# EAGLE design CoCoMEM_RAM (EAGLE 7.7.0)

## Sheet 1 of 3
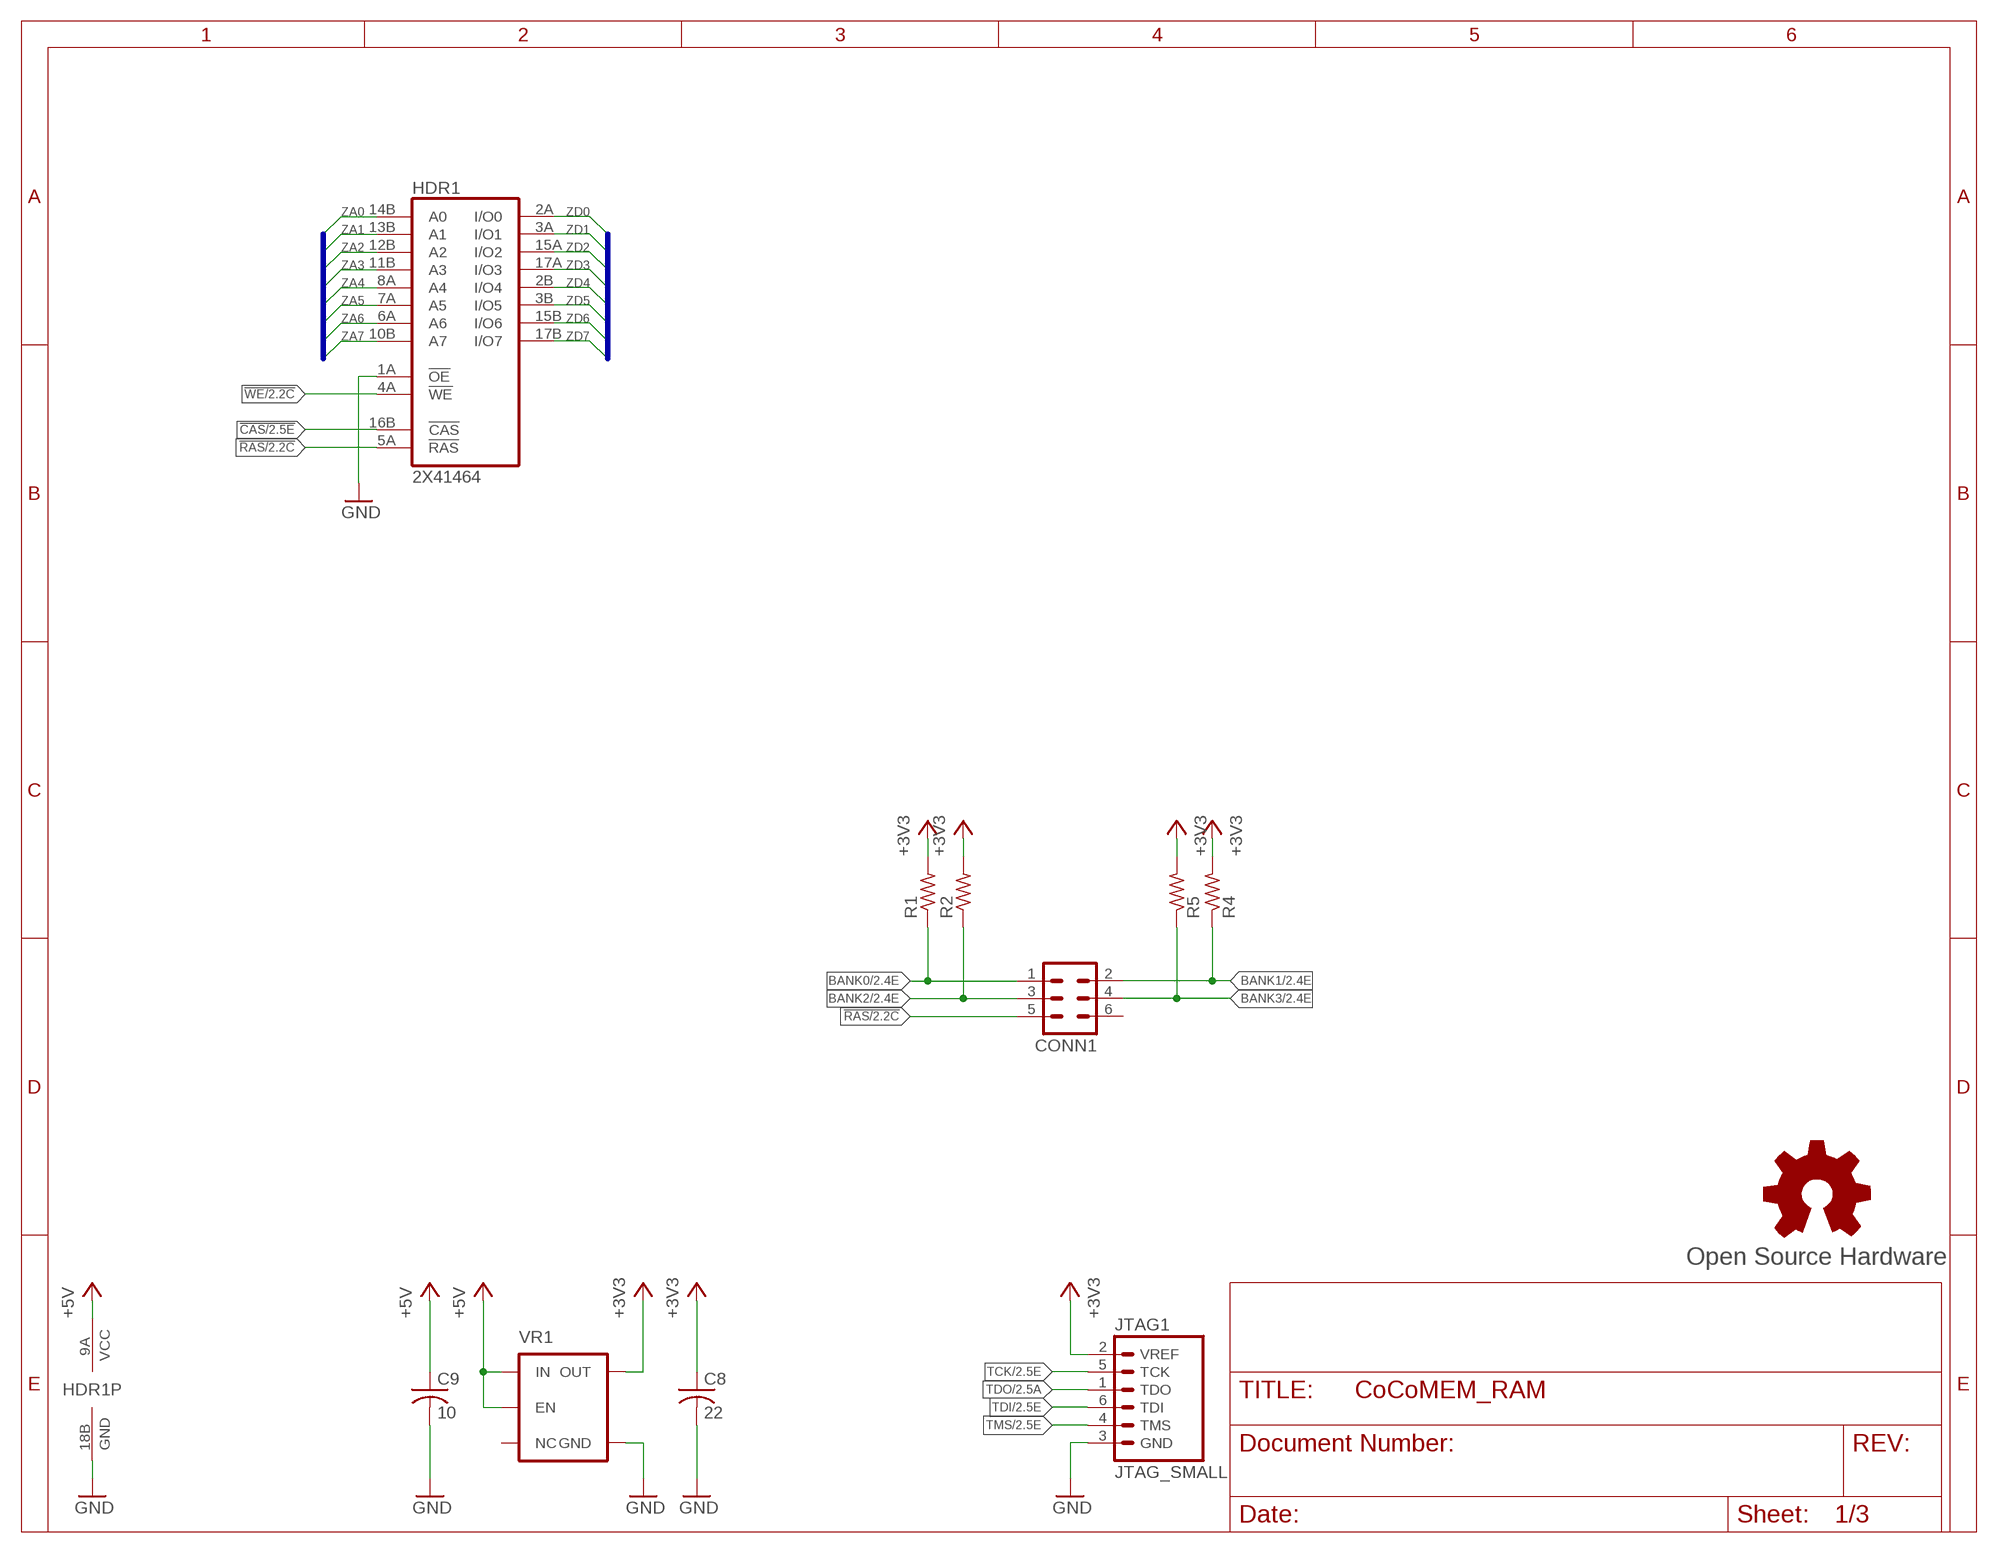
[diagram p0: schematic, sheet 1]

### Parts
C8  22  C-USC0805  [C0805]
C9  10  C-USC0805  [C0805]
CONN1  MA03-2  [MA03-2]
GOLD_ORB_SM1  Open Source Hardware  OSHWLOGOLOGO5MM  [OSHW_5MM]
HDR1  2X41464  [2XDIL18_REV]
JTAG1  JTAG_SMALL  [JTAG-6]
R1  R-US_R0402  [R0402]
R2  R-US_R0402  [R0402]
R4  R-US_R0402  [R0402]
R5  R-US_R0402  [R0402]
VR1  V_REG_TPS76433SOT23-5  [SOT23-5]

### Nets
!CAS: HDR1.16B(!CAS) ; also sheet 2
!RAS: CONN1.5 HDR1.5A(!RAS) ; also sheet 2
!WE: HDR1.4A(!WE) ; also sheet 2
+3V3: C8.1 JTAG1.2(VREF) R1.2 R2.2 R4.2 R5.2 VR1.5(OUT) ; also sheet 2,3
+5V: C9.1 HDR1.9A(VCC) VR1.1(IN) VR1.3(EN)
BANK0: CONN1.1 R1.1 ; also sheet 2
BANK1: CONN1.2 R4.1 ; also sheet 2
BANK2: CONN1.3 R2.1 ; also sheet 2
BANK3: CONN1.4 R5.1 ; also sheet 2
GND: C8.2 C9.2 HDR1.1A(!OE) HDR1.18B(GND) JTAG1.3(GND) VR1.2(GND) ; also sheet 2,3
TCK: JTAG1.5(TCK) ; also sheet 2
TDI: JTAG1.6(TDI) ; also sheet 2
TDO: JTAG1.1(TDO) ; also sheet 2
TMS: JTAG1.4(TMS) ; also sheet 2
ZA0: HDR1.14B(A0) ; also sheet 2
ZA1: HDR1.13B(A1) ; also sheet 2
ZA2: HDR1.12B(A2) ; also sheet 2
ZA3: HDR1.11B(A3) ; also sheet 2
ZA4: HDR1.8A(A4) ; also sheet 2
ZA5: HDR1.7A(A5) ; also sheet 2
ZA6: HDR1.6A(A6) ; also sheet 2
ZA7: HDR1.10B(A7) ; also sheet 2
ZD0: HDR1.2A(I/O0) ; also sheet 2
ZD1: HDR1.3A(I/O1) ; also sheet 2
ZD2: HDR1.15A(I/O2) ; also sheet 2
ZD3: HDR1.17A(I/O3) ; also sheet 2
ZD4: HDR1.2B(I/O4) ; also sheet 2
ZD5: HDR1.3B(I/O5) ; also sheet 2
ZD6: HDR1.15B(I/O6) ; also sheet 2
ZD7: HDR1.17B(I/O7) ; also sheet 2
Unconnected: CONN1.6 VR1.4(NC)

### Buses
ZD[0..7]
ZA[0..7]

## Sheet 2 of 3
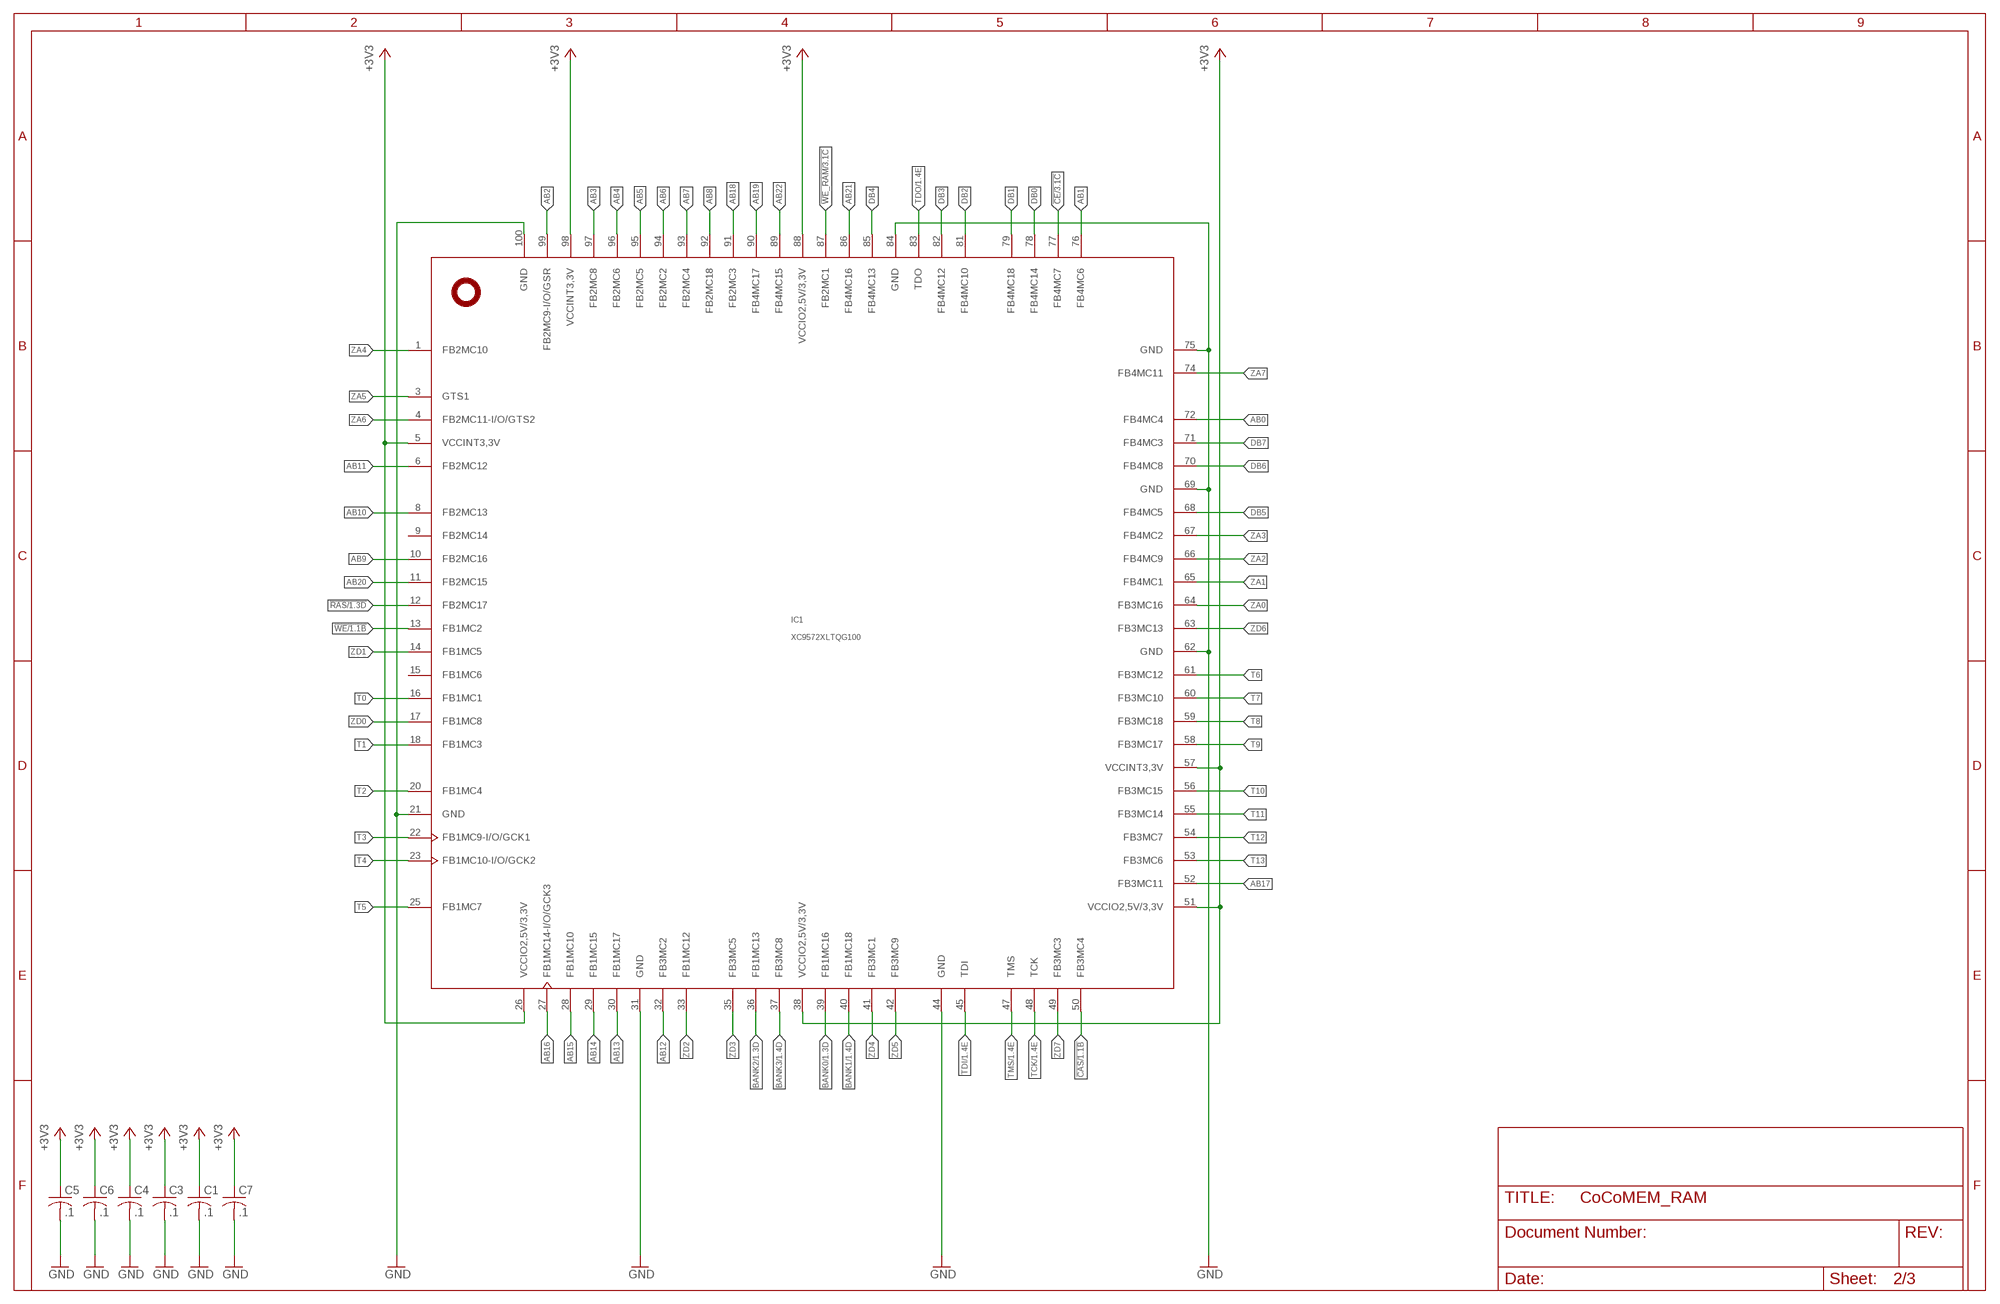
[diagram p1: schematic, sheet 2]

### Parts
C1  .1  C-USC0603  [C0603]
C3  .1  C-USC0603  [C0603]
C4  .1  C-USC0603  [C0603]
C5  .1  C-USC0603  [C0603]
C6  .1  C-USC0603  [C0603]
C7  .1  C-USC0603  [C0603]
IC1  XC9572XLTQG100  [TQFP100]

### Nets
!CAS: IC1.50(FB3MC4) ; also sheet 1
!CE: IC1.77(FB4MC7) ; also sheet 3
!RAS: IC1.12(FB2MC17) ; also sheet 1
!WE: IC1.13(FB1MC2) ; also sheet 1
!WE_RAM: IC1.87(FB2MC1) ; also sheet 3
+3V3: C1.1 C3.1 C4.1 C5.1 C6.1 C7.1 IC1.5(VCCINT3,3V) IC1.26(VCCIO2,5V/3,3V) IC1.38(VCCIO2,5V/3,3V) IC1.51(VCCIO2,5V/3,3V) IC1.57(VCCINT3,3V) IC1.88(VCCIO2,5V/3,3V) IC1.98(VCCINT3,3V) ; also sheet 1,3
AB0: IC1.72(FB4MC4) ; also sheet 3
AB1: IC1.76(FB4MC6) ; also sheet 3
AB2: IC1.99(FB2MC9-I/O/GSR) ; also sheet 3
AB3: IC1.97(FB2MC8) ; also sheet 3
AB4: IC1.96(FB2MC6) ; also sheet 3
AB5: IC1.95(FB2MC5) ; also sheet 3
AB6: IC1.94(FB2MC2) ; also sheet 3
AB7: IC1.93(FB2MC4) ; also sheet 3
AB8: IC1.92(FB2MC18) ; also sheet 3
AB9: IC1.10(FB2MC16) ; also sheet 3
AB10: IC1.8(FB2MC13) ; also sheet 3
AB11: IC1.6(FB2MC12) ; also sheet 3
AB12: IC1.32(FB3MC2) ; also sheet 3
AB13: IC1.30(FB1MC17) ; also sheet 3
AB14: IC1.29(FB1MC15) ; also sheet 3
AB15: IC1.28(FB1MC10) ; also sheet 3
AB16: IC1.27(FB1MC14-I/O/GCK3) ; also sheet 3
AB17: IC1.52(FB3MC11) ; also sheet 3
AB18: IC1.91(FB2MC3) ; also sheet 3
AB19: IC1.90(FB4MC17) ; also sheet 3
AB20: IC1.11(FB2MC15) ; also sheet 3
AB21: IC1.86(FB4MC16) ; also sheet 3
AB22: IC1.89(FB4MC15) ; also sheet 3
BANK0: IC1.39(FB1MC16) ; also sheet 1
BANK1: IC1.40(FB1MC18) ; also sheet 1
BANK2: IC1.36(FB1MC13) ; also sheet 1
BANK3: IC1.37(FB3MC8) ; also sheet 1
DB0: IC1.78(FB4MC14) ; also sheet 3
DB1: IC1.79(FB4MC18) ; also sheet 3
DB2: IC1.81(FB4MC10) ; also sheet 3
DB3: IC1.82(FB4MC12) ; also sheet 3
DB4: IC1.85(FB4MC13) ; also sheet 3
DB5: IC1.68(FB4MC5) ; also sheet 3
DB6: IC1.70(FB4MC8) ; also sheet 3
DB7: IC1.71(FB4MC3) ; also sheet 3
GND: C1.2 C3.2 C4.2 C5.2 C6.2 C7.2 IC1.21(GND) IC1.31(GND) IC1.44(GND) IC1.62(GND) IC1.69(GND) IC1.75(GND) IC1.84(GND) IC1.100(GND) ; also sheet 1,3
T0: IC1.16(FB1MC1)
T1: IC1.18(FB1MC3)
T2: IC1.20(FB1MC4)
T3: IC1.22(FB1MC9-I/O/GCK1)
T4: IC1.23(FB1MC10-I/O/GCK2)
T5: IC1.25(FB1MC7)
T6: IC1.61(FB3MC12)
T7: IC1.60(FB3MC10)
T8: IC1.59(FB3MC18)
T9: IC1.58(FB3MC17)
T10: IC1.56(FB3MC15)
T11: IC1.55(FB3MC14)
T12: IC1.54(FB3MC7)
T13: IC1.53(FB3MC6)
TCK: IC1.48(TCK) ; also sheet 1
TDI: IC1.45(TDI) ; also sheet 1
TDO: IC1.83(TDO) ; also sheet 1
TMS: IC1.47(TMS) ; also sheet 1
ZA0: IC1.64(FB3MC16) ; also sheet 1
ZA1: IC1.65(FB4MC1) ; also sheet 1
ZA2: IC1.66(FB4MC9) ; also sheet 1
ZA3: IC1.67(FB4MC2) ; also sheet 1
ZA4: IC1.1(FB2MC10) ; also sheet 1
ZA5: IC1.3(GTS1) ; also sheet 1
ZA6: IC1.4(FB2MC11-I/O/GTS2) ; also sheet 1
ZA7: IC1.74(FB4MC11) ; also sheet 1
ZD0: IC1.17(FB1MC8) ; also sheet 1
ZD1: IC1.14(FB1MC5) ; also sheet 1
ZD2: IC1.33(FB1MC12) ; also sheet 1
ZD3: IC1.35(FB3MC5) ; also sheet 1
ZD4: IC1.41(FB3MC1) ; also sheet 1
ZD5: IC1.42(FB3MC9) ; also sheet 1
ZD6: IC1.63(FB3MC13) ; also sheet 1
ZD7: IC1.49(FB3MC3) ; also sheet 1
Unconnected: IC1.9(FB2MC14) IC1.15(FB1MC6)

## Sheet 3 of 3
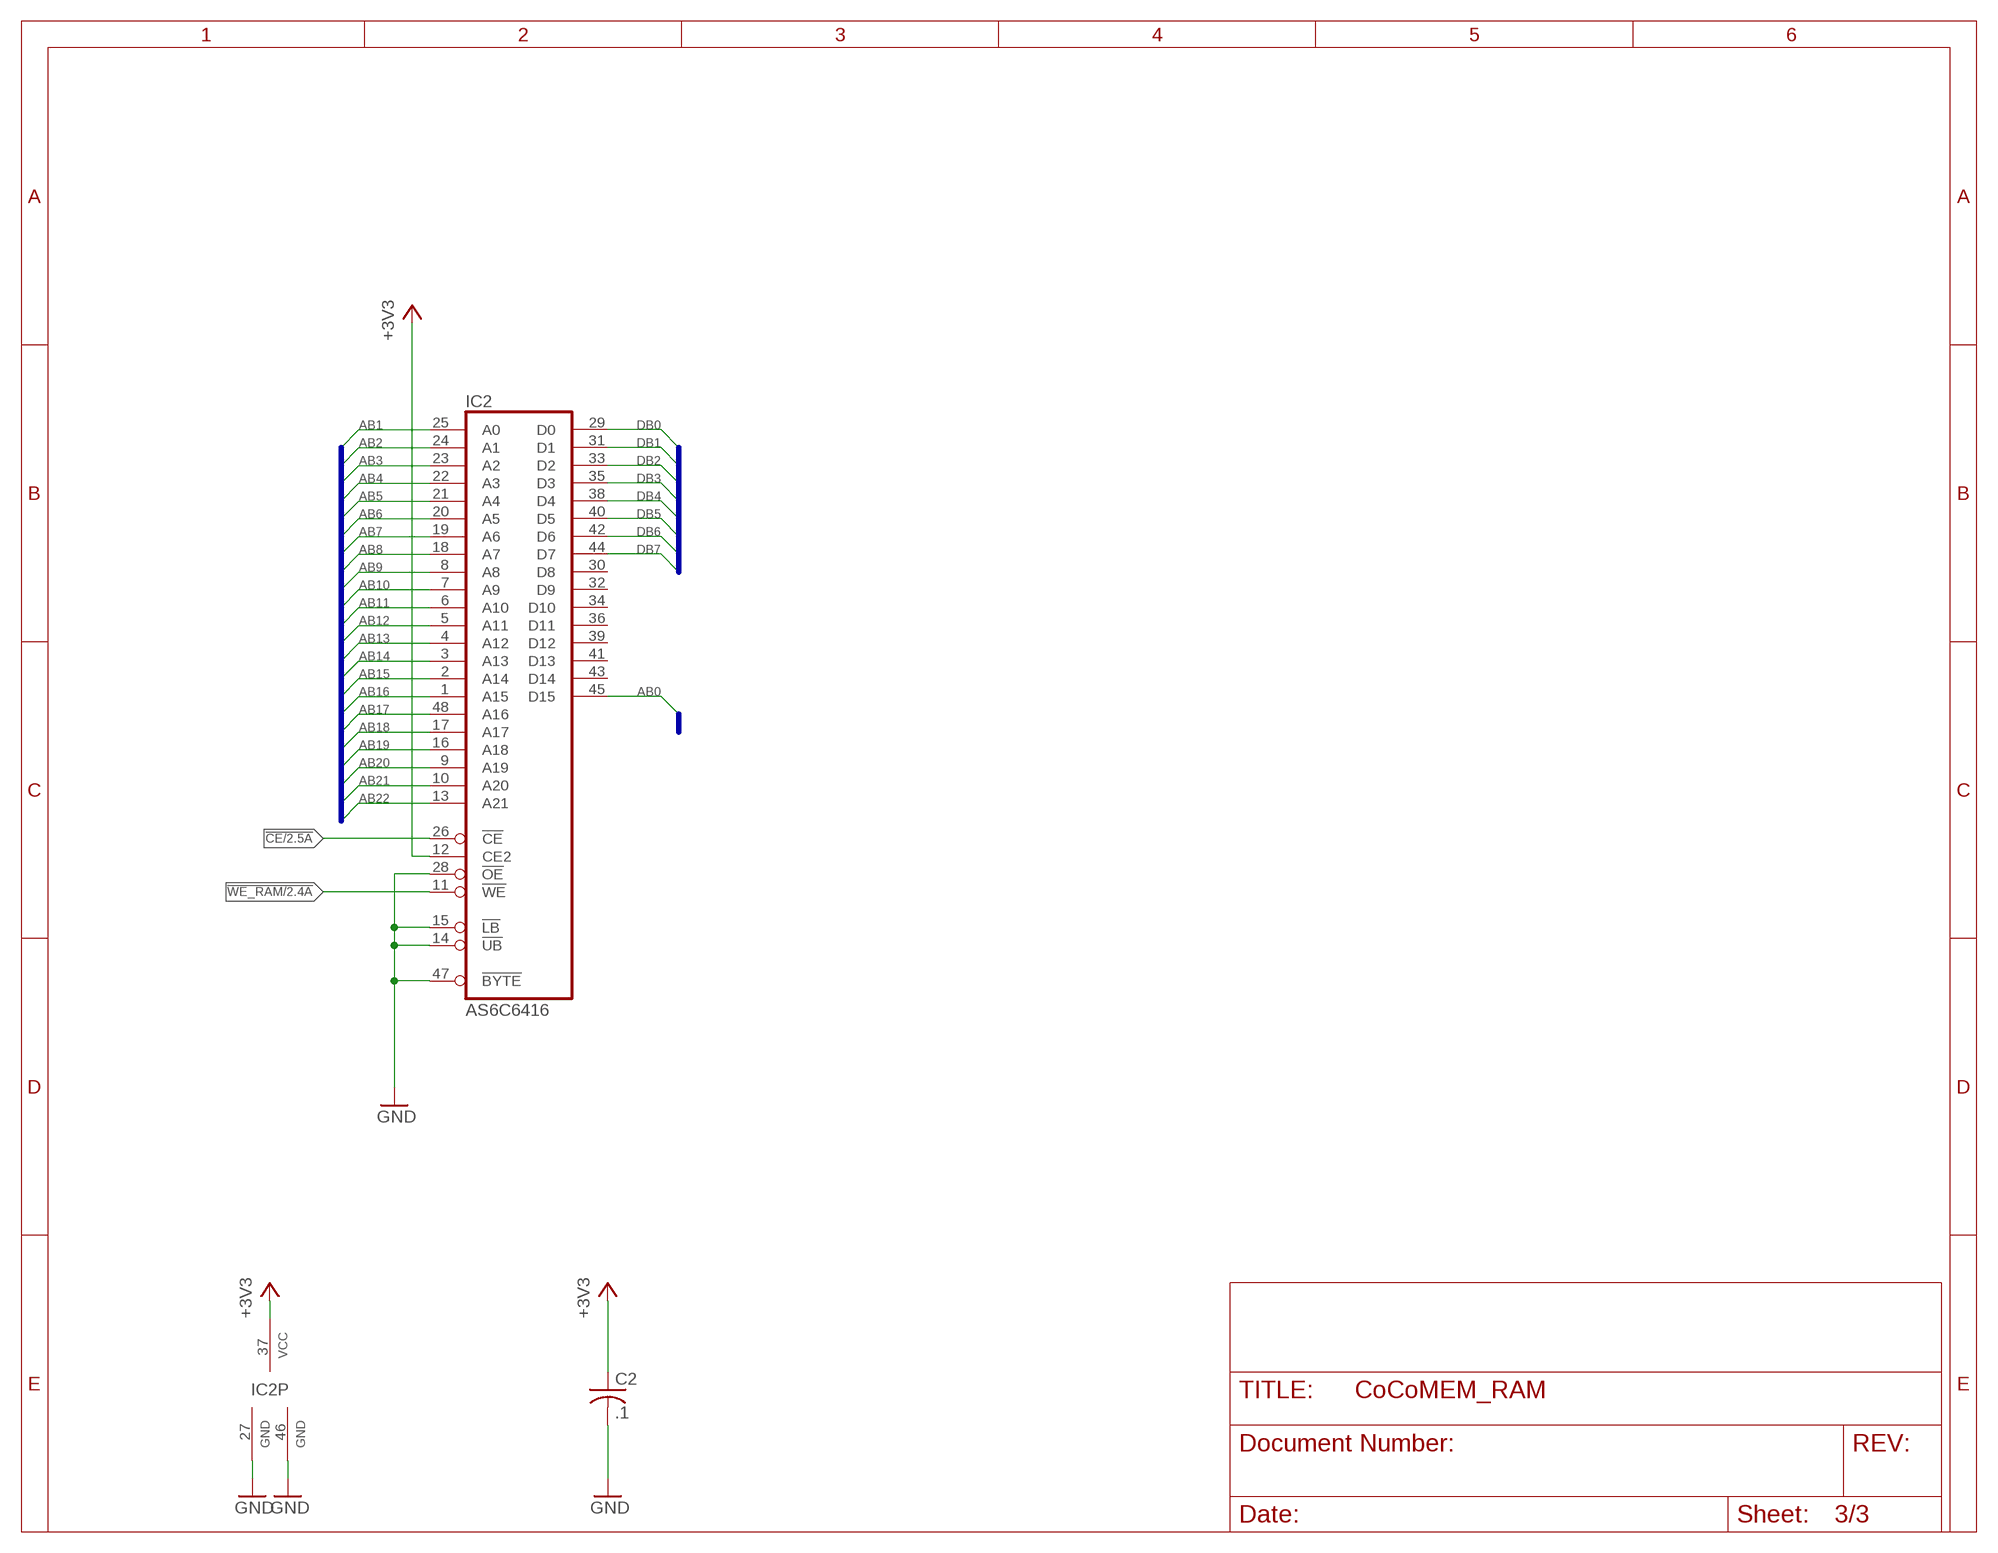
[diagram p2: schematic, sheet 3]

### Parts
C2  .1  C-USC0603  [C0603]
IC2  AS6C6416  [TSOP48]

### Nets
!CE: IC2.26(!CE) ; also sheet 2
!WE_RAM: IC2.11(!WE) ; also sheet 2
+3V3: C2.1 IC2.12(CE2) IC2.37(VCC) ; also sheet 1,2
AB0: IC2.45(D15) ; also sheet 2
AB1: IC2.25(A0) ; also sheet 2
AB2: IC2.24(A1) ; also sheet 2
AB3: IC2.23(A2) ; also sheet 2
AB4: IC2.22(A3) ; also sheet 2
AB5: IC2.21(A4) ; also sheet 2
AB6: IC2.20(A5) ; also sheet 2
AB7: IC2.19(A6) ; also sheet 2
AB8: IC2.18(A7) ; also sheet 2
AB9: IC2.8(A8) ; also sheet 2
AB10: IC2.7(A9) ; also sheet 2
AB11: IC2.6(A10) ; also sheet 2
AB12: IC2.5(A11) ; also sheet 2
AB13: IC2.4(A12) ; also sheet 2
AB14: IC2.3(A13) ; also sheet 2
AB15: IC2.2(A14) ; also sheet 2
AB16: IC2.1(A15) ; also sheet 2
AB17: IC2.48(A16) ; also sheet 2
AB18: IC2.17(A17) ; also sheet 2
AB19: IC2.16(A18) ; also sheet 2
AB20: IC2.9(A19) ; also sheet 2
AB21: IC2.10(A20) ; also sheet 2
AB22: IC2.13(A21) ; also sheet 2
DB0: IC2.29(D0) ; also sheet 2
DB1: IC2.31(D1) ; also sheet 2
DB2: IC2.33(D2) ; also sheet 2
DB3: IC2.35(D3) ; also sheet 2
DB4: IC2.38(D4) ; also sheet 2
DB5: IC2.40(D5) ; also sheet 2
DB6: IC2.42(D6) ; also sheet 2
DB7: IC2.44(D7) ; also sheet 2
GND: C2.2 IC2.14(!UB) IC2.15(!LB) IC2.27(GND) IC2.28(!OE) IC2.46(GND) IC2.47(!BYTE) ; also sheet 1,2
Unconnected: IC2.30(D8) IC2.32(D9) IC2.34(D10) IC2.36(D11) IC2.39(D12) IC2.41(D13) IC2.43(D14)

### Buses
AB[0..21]
DB[0..15]
AB[0..22]

## Library data of the parts
C1-C7 = rcl:C-US: CAPACITOR, American symbol; SPICEPREFIX: C
C8 C9 = resistor:C-US: CAPACITOR, American symbol
CONN1 = con-lstb-rp:MA03-2: PIN HEADER; OC_FARNELL: unknown; OC_NEWARK: unknown
GOLD_ORB_SM1 = oshw:OSHWLOGO: The OSHW logo for PCB layout
HDR1 = coco:2X41464
IC1 = xilinx_xc95XXXxl:XC9572XLTQG100
IC2 = memory-alliance:AS6C6416
JTAG1 = xilinx_xc95XXXxl:JTAG_SMALL
R1 R2 R4 R5 = rcl:R-US_: RESISTOR, American symbol
VR1 = SparkFun:V_REG_TPS76433: Voltage Regulator Older TI part. LDO 150mA regulator. No output by-pass cap option. See V_REG_LDO for a better part.

## Board
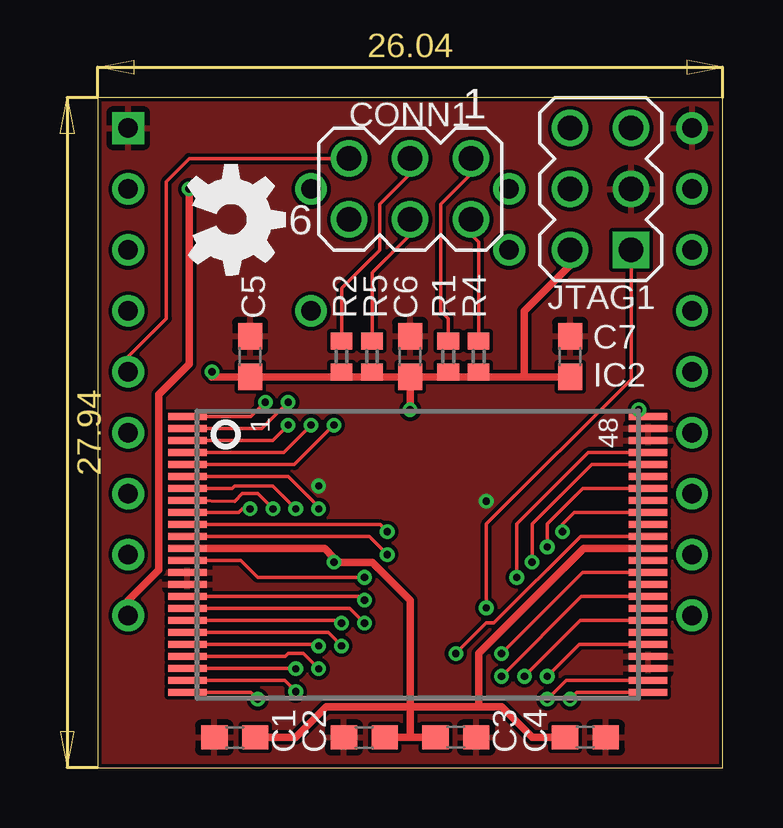
[diagram p3: board, top side]
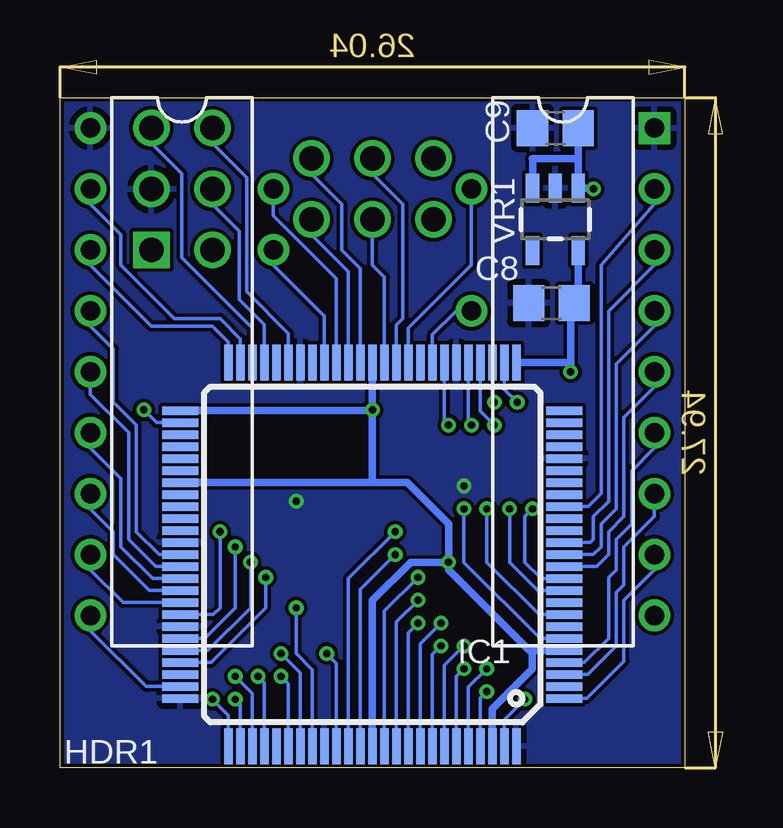
[diagram p4: board, bottom side, seen from below]

Size 26.04 x 27.94 mm. Coordinates in mm from the lower left corner, seen from the top.
Outline: 0,0 26.04,0 26.04,27.94 0,27.94 0,0
Copper layers (1*16): Top 0.035mm / dielectric 1.5mm / Bottom 0.035mm
Design rules "hackvana": minimum track width 6mil, minimum drill 0.3mm, track to track 6mil, track to pad 6mil, pad to pad 6mil, via to via 6mil, smd to smd 0mil, copper to edge 6mil, drill to drill 6mil, minimum pad ring 10mil, minimum via ring 6mil, stop-mask expansion 2mil, vias tented up to drill 100mil, thermal gap 10mil

### Footprints (pad centres in the part's own frame; a part is rotated, then mirrored left to right if it is on the bottom)
C0603 = smd 1.1 x 1: 1 -0.85,0; 2 0.85,0
C0805 = smd 1.3 x 1.5: 1 -0.95,0; 2 0.95,0
MA03-2 = drill 1.016: 1 -2.54,-1.27; 2 -2.54,1.27; 3 0,-1.27; 4 0,1.27; 5 2.54,-1.27; 6 2.54,1.27
2XDIL18_REV = drill 0.813 square: 1A -11.43,10.16 | drill 0.813: 2A -11.43,7.62; 2B 4.445,7.62; 3A -11.43,5.08; 3B 4.445,5.08; 4A -11.43,2.54; 5A -11.43,0; 6A -11.43,-2.54; 7A -11.43,-5.08; 8A -11.43,-7.62; 9A -11.43,-10.16; 10B 12.065,-10.16; 11B 12.065,-7.62; 12B 12.065,-5.08; 13B 12.065,-2.54; 14B 12.065,0; 15A -3.81,2.54; 15B 12.065,2.54; 16B 12.065,5.08; 17A -3.81,7.62; 17B 12.065,7.62; 18B 12.065,10.16
TQFP100 = smd 1.5 x 0.35: 1 -8,6; 2 -8,5.5; 3 -8,5; 4 -8,4.5; 5 -8,4; 6 -8,3.5; 7 -8,3; 8 -8,2.5; 9 -8,2; 10 -8,1.5; 11 -8,1; 12 -8,0.5; 13 -8,0; 14 -8,-0.5; 15 -8,-1; 16 -8,-1.5; 17 -8,-2; 18 -8,-2.5; 19 -8,-3; 20 -8,-3.5; 21 -8,-4; 22 -8,-4.5; 23 -8,-5; 24 -8,-5.5; 25 -8,-6; 51 8,-6; 52 8,-5.5; 53 8,-5; 54 8,-4.5; 55 8,-4; 56 8,-3.5; 57 8,-3; 58 8,-2.5; 59 8,-2; 60 8,-1.5; 61 8,-1; 62 8,-0.5; 63 8,0; 64 8,0.5; 65 8,1; 66 8,1.5; 67 8,2; 68 8,2.5; 69 8,3; 70 8,3.5; 71 8,4; 72 8,4.5; 73 8,5; 74 8,5.5; 75 8,6 | smd 0.35 x 1.5: 26 -6,-8; 27 -5.5,-8; 28 -5,-8; 29 -4.5,-8; 30 -4,-8; 31 -3.5,-8; 32 -3,-8; 33 -2.5,-8; 34 -2,-8; 35 -1.5,-8; 36 -1,-8; 37 -0.5,-8; 38 0,-8; 39 0.5,-8; 40 1,-8; 41 1.5,-8; 42 2,-8; 43 2.5,-8; 44 3,-8; 45 3.5,-8; 46 4,-8; 47 4.5,-8; 48 5,-8; 49 5.5,-8; 50 6,-8; 76 6,8; 77 5.5,8; 78 5,8; 79 4.5,8; 80 4,8; 81 3.5,8; 82 3,8; 83 2.5,8; 84 2,8; 85 1.5,8; 86 1,8; 87 0.5,8; 88 0,8; 89 -0.5,8; 90 -1,8; 91 -1.5,8; 92 -2,8; 93 -2.5,8; 94 -3,8; 95 -3.5,8; 96 -4,8; 97 -4.5,8; 98 -5,8; 99 -5.5,8; 100 -6,8
TSOP48 = smd 1.6 x 0.3: 1 -9.6,5.75; 2 -9.6,5.25; 3 -9.6,4.75; 4 -9.6,4.25; 5 -9.6,3.75; 6 -9.6,3.25; 7 -9.6,2.75; 8 -9.6,2.25; 9 -9.6,1.75; 10 -9.6,1.25; 11 -9.6,0.75; 12 -9.6,0.25; 13 -9.6,-0.25; 14 -9.6,-0.75; 15 -9.6,-1.25; 16 -9.6,-1.75; 17 -9.6,-2.25; 18 -9.6,-2.75; 19 -9.6,-3.25; 20 -9.6,-3.75; 21 -9.6,-4.25; 22 -9.6,-4.75; 23 -9.6,-5.25; 24 -9.6,-5.75; 25 9.6,-5.75; 26 9.6,-5.25; 27 9.6,-4.75; 28 9.6,-4.25; 29 9.6,-3.75; 30 9.6,-3.25; 31 9.6,-2.75; 32 9.6,-2.25; 33 9.6,-1.75; 34 9.6,-1.25; 35 9.6,-0.75; 36 9.6,-0.25; 37 9.6,0.25; 38 9.6,0.75; 39 9.6,1.25; 40 9.6,1.75; 41 9.6,2.25; 42 9.6,2.75; 43 9.6,3.25; 44 9.6,3.75; 45 9.6,4.25; 46 9.6,4.75; 47 9.6,5.25; 48 9.6,5.75
JTAG-6 = drill 1.016 square: 1 -5.08,-1.27 | drill 1.016: 2 -5.08,1.27; 3 -2.54,-1.27; 4 -2.54,1.27; 5 0,-1.27; 6 0,1.27
R0402 = smd 0.7 x 0.9: 1 -0.65,0; 2 0.65,0
SOT23-5 = smd 0.55 x 1.2: 1 -0.95,-1.3; 2 0,-1.3; 3 0.95,-1.3; 4 0.95,1.3; 5 -0.95,1.3

### Placement (x,y rotation side)
C1  5.71,1.27 180 top
C2  11.11,1.27 180 top
C3  14.92,1.27 0 top
C4  20.32,1.27 0 top
C5  6.35,17.14 90 top
C6  13.02,17.14 90 top
C7  19.68,17.14 90 top
C8  5.56,19.37 180 bottom
C9  5.4,26.67 180 bottom
CONN1  13.02,24.13 180 top
GOLD_ORB_SM1  5.56,22.86 270 top
HDR1  12.7,16.51 0 top
IC1  13.02,8.89 180 bottom
IC2  13.33,8.89 0 top
JTAG1  20.95,26.67 90 top
R1  14.6,17.14 270 top
R2  10.16,17.14 270 top
R4  15.88,17.14 270 top
R5  11.43,17.14 270 top
VR1  5.4,22.86 180 bottom

### Tracks (layer width: path | path; a pad name or v marks a point on that pad's centre or on a via)
!CAS
  Bottom 0.152: IC1.50 19.02,17.75 19.68,18.41 22.23,18.41 24.77,20.95 HDR1.16B
!CE  (via drill 0.3)
  Top 0.152: v18.73,2.86 19.52,3.64 IC2.26
  Bottom 0.152: IC1.77 18.52,2.64 v18.73,2.86
!RAS
  Top 0.152: HDR1.5A 1.27,17.14 2.86,18.73 2.86,24.45 3.81,25.4 CONN1.5
  Bottom 0.152: HDR1.5A 1.27,15.88 2.54,14.61 2.54,10.48 3.17,9.84 3.17,8.89 3.67,8.39 IC1.12
!WE
  Bottom 0.152: HDR1.4A 1.27,18.41 2.86,16.83 2.86,10.79 3.49,10.16 3.49,9.21 3.81,8.89 IC1.13
!WE_RAM  (via drill 0.3)
  Top 0.152: IC2.11 11.31,9.64 v12.06,8.89
  Bottom 0.152: v12.06,8.89 13.52,7.44 IC1.87
+3V3  (via drill 0.3)
  Top 0.305: IC2.12 9.46,9.14 9.84,8.76 v9.84,8.57 11.43,8.57 13.02,6.98 13.02,2.54 | C3.1 C2.1 13.02,1.27 13.02,2.54 | C4.1 18.1,1.27 16.83,2.54 15.88,2.54 | C1.1 8.25,1.27 9.52,2.54 13.02,2.54 | 15.88,2.54 13.02,2.54 | 10.16,16.29 C5.1 4.76,16.29 v4.76,16.51 | 10.16,16.29 11.43,16.29 | 11.43,16.29 C6.1 | C6.1 14.6,16.29 | 14.6,16.29 15.88,16.29 | 15.88,16.29 17.78,16.29 | 17.78,16.29 C7.1 | C6.1 v13.02,14.92 | JTAG1.2 19.68,20.95 17.78,19.05 17.78,16.29 | R2.2 10.16,16.29 | R5.2 11.43,16.29 | R1.2 14.6,16.29 | R4.2 15.88,16.29 | IC2.37 20.25,9.14 15.88,4.76 15.88,2.54
  Bottom 0.305: IC1.5 6.35,4.89 | 6.35,4.89 6.48,4.89 9.84,8.26 v9.84,8.57 | IC1.98 8.02,2.46 6.35,4.13 6.35,4.89 | IC1.88 13.02,6.98 11.43,8.57 v9.84,8.57 | IC1.57 13.02,11.89 | 13.02,11.89 11.57,11.89 9.84,10.16 v9.84,8.57 | IC1.38 v13.02,14.92 | v13.02,14.92 13.02,14.89 | 13.02,14.89 13.02,11.89 | IC1.51 13.05,14.89 | 13.05,14.89 13.02,14.89 | v13.02,14.92 13.05,14.89 | VR1.5 4.45,20 C8.1 4.76,19.37 v4.76,16.51 4.76,16.89 IC1.26
+5V  (via drill 0.3)
  Top 0.305: HDR1.9A 1.27,6.98 2.54,8.26 2.54,15.56 3.81,16.83 v3.81,24.13
  Bottom 0.305: 4.45,25.4 VR1.1 3.84,24.16 v3.81,24.13 | 4.45,25.4 C9.1 | VR1.3 6.35,25.4 | 6.35,25.4 | 6.35,25.4 4.45,25.4
AB0  (via drill 0.3)
  Top 0.152: IC2.45 20.44,13.14 17.46,10.16 v17.46,7.94
  Bottom 0.152: v17.46,7.94 17.46,6.67 19.74,4.39 IC1.72
AB1  (via drill 0.3)
  Top 0.152: IC2.25 19.97,3.14 v19.68,2.86
  Bottom 0.152: v19.68,2.86 19.02,2.19 IC1.76
AB2  (via drill 0.3)
  Top 0.152: IC2.24 6.38,3.14 v6.67,2.86
  Bottom 0.152: IC1.99 7.52,2.01 v6.67,2.86
AB3  (via drill 0.3)
  Top 0.152: IC2.23 7.79,3.64 v8.25,3.17
  Bottom 0.152: IC1.97 8.52,2.91 v8.25,3.17
AB4  (via drill 0.3)
  Top 0.152: IC2.22 v8.24,4.14 v8.25,4.13
  Bottom 0.152: IC1.96 9.02,3.37 v8.25,4.13
AB5  (via drill 0.3)
  Top 0.152: IC2.21 7.81,4.64 7.94,4.76 8.57,4.76 v9.21,4.13
  Bottom 0.152: IC1.95 9.52,3.82 v9.21,4.13
AB6  (via drill 0.3)
  Top 0.152: IC2.20 9.15,5.14 v9.21,5.08
  Bottom 0.152: IC1.94 10.02,4.27 v9.21,5.08
AB7  (via drill 0.3)
  Top 0.152: IC2.19 9.6,5.64 v10.16,5.08
  Bottom 0.152: IC1.93 10.52,4.72 v10.16,5.08
AB8  (via drill 0.3)
  Top 0.152: IC2.18 10.05,6.14 v10.16,6.03
  Bottom 0.152: IC1.92 11.02,5.17 v10.16,6.03
AB9  (via drill 0.3)
  Top 0.152: IC2.8 5.71,11.11 6.03,11.43 6.67,11.43 6.96,11.14 v7.3,10.79
  Bottom 0.152: v7.3,10.79 7.3,8.57 6.12,7.39 IC1.10
AB10  (via drill 0.3)
  Top 0.152: IC2.7 5.61,11.64 5.71,11.75 7.3,11.75 v8.25,10.79
  Bottom 0.152: IC1.8 6.07,6.39 8.25,8.57 v8.25,10.79
AB11  (via drill 0.3)
  Top 0.152: IC2.6 7.94,12.14 9.21,10.87 v9.21,10.79
  Bottom 0.152: v9.21,10.79 9.21,8.57 6.02,5.39 IC1.6
AB12  (via drill 0.3)
  Top 0.152: v9.84,14.29 8.2,12.64 IC2.5
  Bottom 0.152: IC1.32 10.02,14.46 v9.84,14.29
AB13  (via drill 0.3)
  Top 0.152: v8.89,14.29 7.74,13.14 IC2.4
  Bottom 0.152: IC1.30 9.02,14.42 v8.89,14.29
AB14  (via drill 0.3)
  Top 0.152: v7.94,14.29 7.29,13.64 IC2.3
  Bottom 0.152: IC1.29 8.52,14.87 v7.94,14.29
AB15  (via drill 0.3)
  Top 0.152: IC2.2 6.84,14.14 v7.94,15.24
  Bottom 0.152: v7.94,15.24 8.02,15.32 IC1.28
AB16  (via drill 0.3)
  Top 0.152: v6.98,15.24 6.38,14.64 IC2.1
  Bottom 0.152: IC1.27 7.52,15.77 v6.98,15.24
AB17  (via drill 0.3)
  Top 0.152: v22.54,14.92 22.65,14.92 IC2.48
  Bottom 0.152: IC1.52 22.01,14.39 v22.54,14.92
AB18  (via drill 0.3)
  Top 0.152: v11.11,6.03 10.5,6.64 IC2.17
  Bottom 0.152: IC1.91 11.52,5.63 v11.11,6.03
AB19  (via drill 0.3)
  Top 0.152: IC2.16 10.96,7.14 v11.11,6.98
  Bottom 0.152: v11.11,6.98 12.02,6.08 IC1.90
AB20  (via drill 0.3)
  Top 0.152: v6.35,10.79 6.03,10.79 5.88,10.64 IC2.9
  Bottom 0.152: v6.35,10.79 6.67,10.48 6.67,8.57 5.98,7.89 IC1.11
AB21  (via drill 0.3)
  Top 0.152: IC2.10 11.77,10.14 v12.06,9.84
  Bottom 0.152: v12.06,9.84 14.02,7.89 IC1.86
AB22  (via drill 0.3)
  Top 0.152: v11.11,7.94 6.67,7.94 5.96,8.64 IC2.13
  Bottom 0.152: IC1.89 12.52,6.53 v11.11,7.94
BANK0
  Top 0.152: R1.1 14.6,18.73 14.29,19.05 14.29,23.49 15.56,24.76 CONN1.1
  Bottom 0.152: CONN1.1 15.56,24.76 14.29,23.49 14.29,21.59 13.52,20.82 IC1.39
BANK1
  Top 0.152: R4.1 15.88,21.91 15.56,22.22 CONN1.2
  Bottom 0.152: CONN1.2 15.56,22.22 14.02,20.68 IC1.40
BANK2
  Top 0.152: CONN1.3 13.02,24.76 11.75,23.49 11.75,21.59 10.16,20 R2.1
  Bottom 0.152: CONN1.3 13.02,24.76 11.75,23.49 11.75,18.73 12.02,18.46 IC1.36
BANK3
  Top 0.152: CONN1.4 13.02,22.22 11.43,20.64 R5.1
  Bottom 0.152: CONN1.4 13.02,20.95 12.52,20.45 IC1.37
DB0  (via drill 0.3)
  Top 0.152: IC2.29 20.06,5.14 v18.73,3.81
  Bottom 0.152: v18.73,3.81 18.02,3.1 IC1.78
DB1  (via drill 0.3)
  Top 0.152: IC2.31 20.11,6.14 v17.78,3.81
  Bottom 0.152: v17.78,3.81 17.52,3.55 IC1.79
DB2  (via drill 0.3)
  Top 0.152: v16.83,3.81 20.16,7.14 IC2.33
  Bottom 0.152: IC1.81 16.52,3.5 v16.83,3.81
DB3  (via drill 0.3)
  Top 0.152: v16.83,4.76 20.2,8.14 IC2.35
  Bottom 0.152: IC1.82 16.02,3.95 v16.83,4.76
DB4  (via drill 0.3)
  Top 0.152: IC2.38 20.12,9.64 16.51,6.03 16.19,6.03 v14.92,4.76
  Bottom 0.152: v14.92,4.76 14.52,4.36 IC1.85
DB5  (via drill 0.3)
  Top 0.152: v19.37,9.84 19.37,10.16 19.85,10.64 IC2.40
  Bottom 0.152: v19.37,9.84 19.37,6.67 19.64,6.39 IC1.68
DB6  (via drill 0.3)
  Top 0.152: v18.73,9.21 18.73,10.16 20.21,11.64 IC2.42
  Bottom 0.152: v18.73,9.21 18.73,6.67 20.01,5.39 IC1.70
DB7  (via drill 0.3)
  Top 0.152: v18.1,8.57 18.1,10.16 20.58,12.64 IC2.44
  Bottom 0.152: v18.1,8.57 18.1,6.67 19.88,4.89 IC1.71
GND  (via drill 0.3)
  other vias: 16.19,11.11 9.21,11.75
  pour Top: 0,27.94 26.04,27.94 26.04,0 0,0
  pour Bottom: 0,27.94 26.04,27.94 26.04,0 0,0
TCK
  Bottom 0.152: JTAG1.5 22.23,26.04 20.95,24.76 20.95,21.27 18.02,18.34 IC1.48
TDI
  Bottom 0.152: JTAG1.6 19.68,26.04 18.26,24.61 18.26,19.84 16.52,18.11 IC1.45
TDO  (via drill 0.3)
  Top 0.152: v16.19,6.67 16.19,10.16 22.23,16.19 JTAG1.1
  Bottom 0.152: IC1.83 15.52,4.09 16.19,4.76 v16.19,6.67
TMS
  Bottom 0.152: JTAG1.4 19.68,23.49 18.57,22.38 18.57,19.53 17.52,18.47 IC1.47
ZA0
  Bottom 0.152: HDR1.14B 24.77,15.56 23.18,13.97 23.18,9.53 22.04,8.39 IC1.64
ZA1
  Bottom 0.152: HDR1.13B 24.77,13.34 23.49,12.07 23.49,9.21 22.18,7.89 IC1.65
ZA2
  Bottom 0.152: HDR1.12B 24.77,10.79 23.81,9.84 23.81,8.89 22.31,7.39 IC1.66
ZA3
  Bottom 0.152: HDR1.11B 24.77,8.26 23.4,6.89 IC1.67
ZA4
  Bottom 0.152: IC1.1 4.09,2.89 2.54,4.45 2.54,6.98 1.27,8.26 HDR1.8A
ZA5
  Bottom 0.152: HDR1.7A 1.27,10.48 2.54,9.21 2.54,7.62 2.86,7.3 2.86,5.08 4.05,3.89 IC1.3
ZA6
  Bottom 0.152: HDR1.6A 1.27,13.34 2.22,12.38 2.22,10.16 2.86,9.53 2.86,8.26 3.17,7.94 3.17,5.4 4.18,4.39 IC1.4
ZA7
  Bottom 0.152: IC1.74 22.44,3.39 24.77,5.71 HDR1.10B
ZD0
  Bottom 0.152: HDR1.2A 1.27,23.49 3.49,20.95 3.49,11.43 4.03,10.89 IC1.17
ZD1
  Bottom 0.152: HDR1.3A 1.27,20.95 3.17,19.05 3.17,11.11 3.81,10.48 3.81,9.53 3.94,9.39 IC1.14
ZD2
  Bottom 0.152: IC1.33 10.52,18.06 9.52,19.05 HDR1.15A
ZD3
  Bottom 0.152: HDR1.17A 8.89,20.95 11.52,18.33 IC1.35
ZD4
  Bottom 0.152: IC1.41 14.52,20.39 17.14,23.02 HDR1.2B
ZD5
  Bottom 0.152: IC1.42 15.02,18.83 17.14,20.95 HDR1.3B
ZD6
  Bottom 0.152: HDR1.15B 24.77,18.41 23.81,17.46 23.81,15.24 22.86,14.29 22.86,9.84 21.91,8.89 IC1.63
ZD7
  Bottom 0.152: HDR1.17B 24.77,23.49 23.49,22.22 23.49,20.95 21.27,18.73 19.37,18.73 18.52,17.88 IC1.49

### Text on the board
tValues: CoCoMEM Jr 2MB/8MB SRAM (c) go4retro.com